# EAGLE design Board 7 Segment (EAGLE 6.5.0)
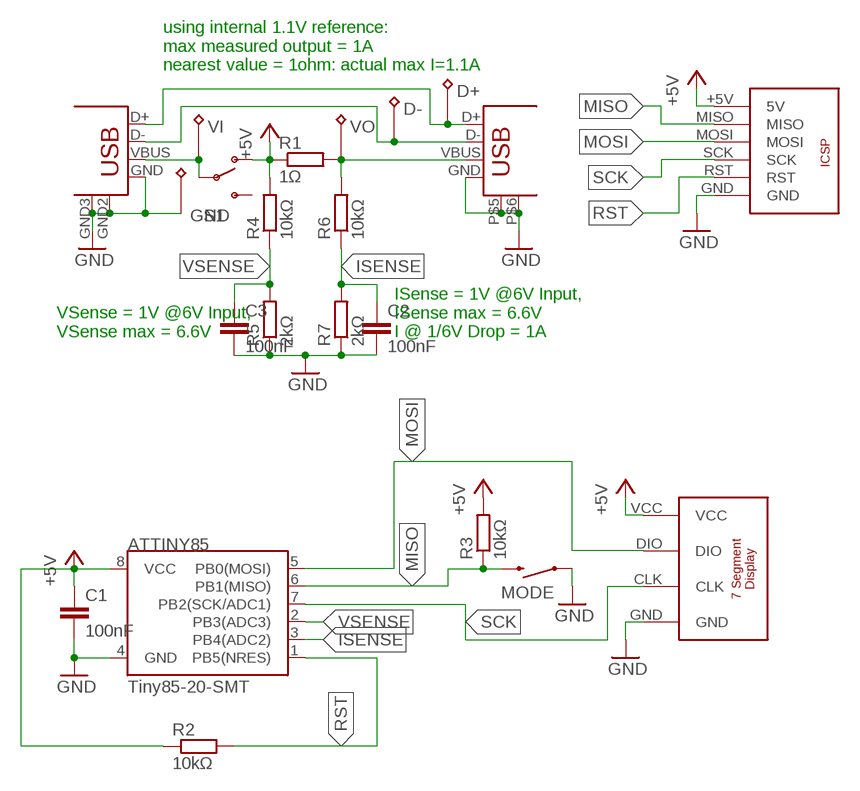
[diagram p0: schematic, sheet 1]

## Parts
ATTINY85  Tiny85-20-SMT  ATTINY45TINY85-20-SMT  [SO08-EIAJ]
C1  100nF  C-EUC0603  [C0603]
C2  100nF  C-EUC0603  [C0603]
C3  100nF  C-EUC0603  [C0603]
D+  TESTPOINT0.8MM-DUAL-DRILL-WIRE-LOOP  [TP-0.8MM-DUAL]
D-  TESTPOINT0.8MM-DUAL-DRILL-WIRE-LOOP  [TP-0.8MM-DUAL]
GND  TESTPOINT0.8MM-DUAL-DRILL-WIRE-LOOP  [TP-0.8MM-DUAL]
INPUT  USB+SHIELDTHROUGHHOLE-MALE  [USB-A-H]
MODE  SWITCH-MOMENTARY-2SIDE_EZ  [TACTILE-PTH-SIDEEZ]
OUTPUT  USB+SHIELDTHROUGHOLE-FEMALE  [USB-A-S-SILK-THROUGHHOLE]
R1  1Ω  R-EU_R2512  [R2512]
R2  10kΩ  R-EU_R0603  [R0603]
R3  10kΩ  R-EU_R0603  [R0603]
R4  10kΩ  R-EU_R0603  [R0603]
R5  2kΩ  R-EU_R0603  [R0603]
R6  10kΩ  R-EU_R0603  [R0603]
R7  2kΩ  R-EU_R0603  [R0603]
S1  SWITCH-SPDT-SMD-A  [SWITCH-SPST-SMD-A]
U$1  ICSPTHROUGHHOLE  [ICSP-THROUGHHOLE]
U$2  7-SEGMENT-I2C  [7-SEGMENT-I2C]
VI  TESTPOINT0.8MM-DUAL-DRILL-WIRE-LOOP  [TP-0.8MM-DUAL]
VO  TESTPOINT0.8MM-DUAL-DRILL-WIRE-LOOP  [TP-0.8MM-DUAL]

## Nets
+5V: ATTINY85.8(VCC) C1.1 R1.1 R2.1 R3.2 R4.2 S1.1(O) U$1.+5V(5V) U$2.VCC
GND: ATTINY85.4(GND) C1.2 C2.2 C3.2 GND.P$1(TP) GND.P$2(TP) INPUT.GND INPUT.GND2(S1) INPUT.GND3(S2) MODE.1 OUTPUT.GND OUTPUT.P$5(S1) OUTPUT.P$6(S2) R5.1 R7.1 U$1.GND U$2.GND
ISENSE: ATTINY85.3(PB4(ADC2)) C2.1 R6.1 R7.2
MISO: ATTINY85.6(PB1(MISO)) MODE.2 R3.1 U$1.MISO
MOSI: ATTINY85.5(PB0(MOSI)) U$1.MOSI U$2.DIO
N$1: D+.P$1(TP) D+.P$2(TP) INPUT.D+ OUTPUT.D+
N$2: D-.P$1(TP) D-.P$2(TP) INPUT.D- OUTPUT.D-
N$3: INPUT.VBUS S1.2(P) VI.P$1(TP) VI.P$2(TP)
N$6: OUTPUT.VBUS R1.2 R6.2 VO.P$1(TP) VO.P$2(TP)
RST: ATTINY85.1(PB5(NRES)) R2.2 U$1.RST
SCK: ATTINY85.7(PB2(SCK/ADC1)) U$1.SCK U$2.CLK
VSENSE: ATTINY85.2(PB3(ADC3)) C3.1 R4.1 R5.2
Unconnected: S1.3(S)

## Notes on the sheet
- using internal 1.1V reference:
  max measured output = 1A
  nearest value = 1ohm: actual max I=1.1A
- VSense = 1V @6V Input, 
  VSense max = 6.6V
- ISense = 1V @6V Input, 
  ISense max = 6.6V
  I @ 1/6V Drop = 1A

## Library data of the parts
ATTINY85 = SparkFun-DigitalIC:ATTINY45: Atmel 8-pin 2/4/8kB flash uC; PROD_ID: IC-09092
C1-C3 = rcl:C-EU: CAPACITOR, European symbol
D+ D- GND VI VO = OwnStuff:TESTPOINT
INPUT OUTPUT = SparkFun-Connectors:USB+SHIELD: USB+Shield USB connector with shield pins connectable
MODE = SparkFun-Electromechanical:SWITCH-MOMENTARY-2: Various NO switches- pushbuttons, reed, etc
R1-R7 = rcl:R-EU_: RESISTOR, European symbol
S1 = SparkFun-Electromechanical:SWITCH-SPDT: SPDT Switch Simple slide switch, Spark Fun Electronics SKU : COM-00102 DPDT SMT slide switch, AYZ0202, SWCH-08179
U$1 = OwnStuff:ICSP
U$2 = OwnStuff:7-SEGMENT-I2C

## Board
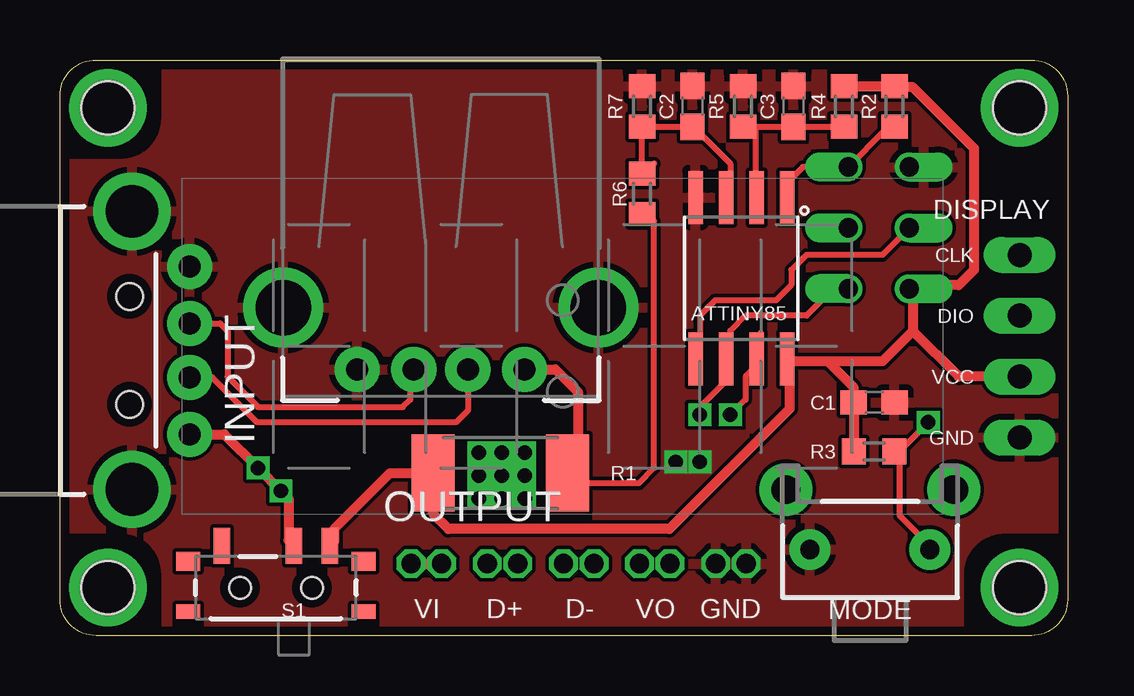
[diagram p1: board, top side]
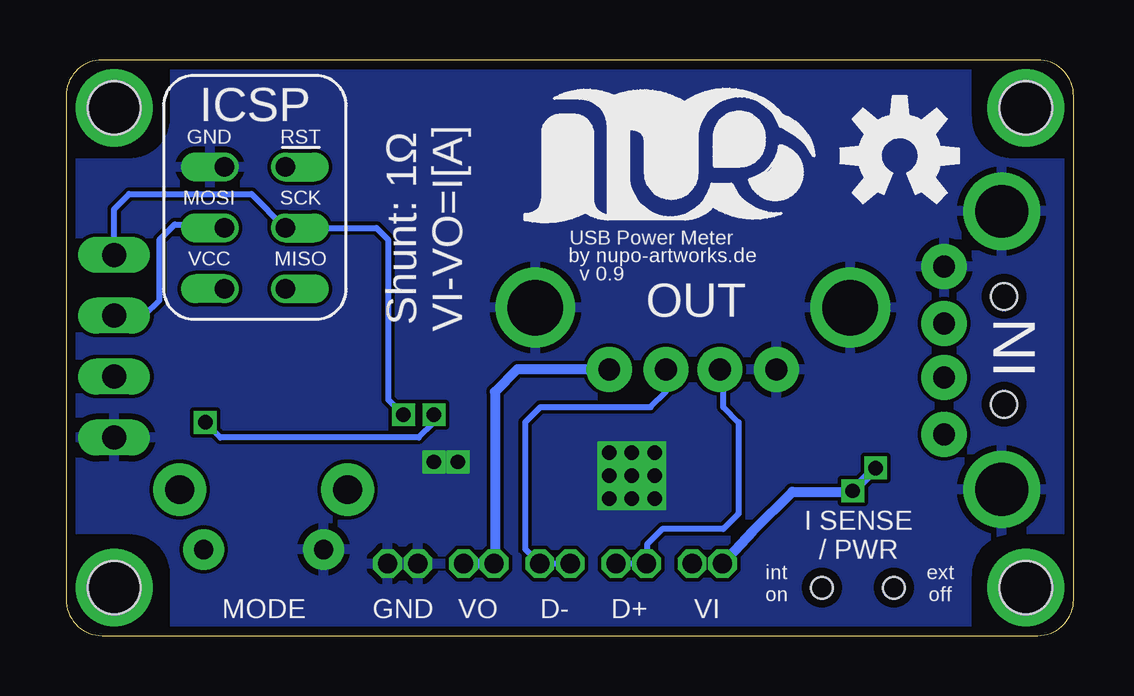
[diagram p2: board, bottom side, seen from below]

Size 42 x 24 mm. Coordinates in mm from the lower left corner, seen from the top.
Outline: 0,1.5 0,22.5 arc-90 1.5,24 40.5,24 arc-90 42,22.5 42,1.5 arc-90 40.5,0 1.5,0 arc-90 0,1.5
Copper layers (1*16): Top 0.0356mm / dielectric 1.5011mm / Bottom 0.0356mm
Design rules "LaenPCBOrder *": minimum track width 6mil, minimum drill 13mil, track to track 6mil, track to pad 6mil, pad to pad 6mil, via to via 6mil, smd to smd 6mil, copper to edge 15mil, drill to drill 6mil, minimum pad ring 7mil, minimum via ring 7mil, stop-mask expansion 3mil, vias tented up to drill 13mil, thermal gap 10mil

### Footprints (pad centres in the part's own frame; a part is rotated, then mirrored left to right if it is on the bottom)
SO08-EIAJ = smd 0.61 x 2.21: 1 -1.905,-3.378; 2 -0.635,-3.378; 3 0.635,-3.378; 4 1.905,-3.378; 5 1.905,3.353; 6 0.635,3.353; 7 -0.635,3.353; 8 -1.905,3.353
C0603 = smd 1.1 x 1: 1 -0.85,0; 2 0.85,0
TP-0.8MM-DUAL = drill 0.8 octagon: P$1 0,0; P$2 0,1.27
USB-A-H = drill 0.914 pad 1.88: D+ 2.4,1.127; D- 2.4,-1.127; GND 2.4,3.5; VBUS 2.4,-3.5 | drill 2.2: GND2 0,-5.8; GND3 0,5.8 | hole 1.1: -0.1,2.25; -0.1,-2.25
TACTILE-PTH-SIDEEZ = drill 0.8 pad 1.7: 1 -2.5,0; 2 2.5,0 | drill 1.2 pad 2.2: ANCHOR1 -3.5,2.5; ANCHOR2 3.5,2.5
USB-A-S-SILK-THROUGHHOLE = drill 0.914 pad 1.88: D+ 3.035,-1.127; D- 3.035,1.127; GND 3.035,-3.485; VBUS 3.035,3.485 | drill 2.311: P$5 0.46,-6.566; P$6 0.46,6.566
R2512 = smd 1.8 x 3.2: 1 -2.8,0; 2 2.8,0
R0603 = smd 1 x 1.1: 1 -0.85,0; 2 0.85,0
SWITCH-SPST-SMD-A = smd 0.7 x 1.5: 1 -2.25,-1.75; 2 -0.75,-1.75; 3 2.25,-1.75 | smd 1 x 0.6: GND1 -3.65,1; GND3 3.65,1 | smd 1 x 0.8: GND2 -3.65,-1.1; GND4 3.65,-1.1 | hole 0.9: -1.5,0; 1.5,0
ICSP-THROUGHHOLE = drill 0.8 offset: +5V 1.27,2.54; GND 1.27,-2.54; MISO -1.27,2.54; MOSI 1.27,0; RST -1.27,-2.54; SCK -1.27,0
7-SEGMENT-I2C = drill 1 long: CLK 40.005,15.875; DIO 40.005,13.335; GND 40.005,8.255; VCC 40.005,10.795 | hole 2.2: 2,22; 2,2; 40,2; 40,22

### Placement (x,y rotation side)
ATTINY85  28.4,14.89 180 top
C1  33.94,9.71 0 top
C2  26.37,22.07 90 top
C3  30.58,22.07 90 top
D+  19.08,3 90 top
D-  22.25,3 90 top
GND  28.61,3 90 top
INPUT  3,11.89 0 top
MODE  33.77,3.59 0 top
OUTPUT  15.88,14.13 270 top
R1  18.35,6.78 0 top
R2  34.78,22.07 270 top
R3  33.94,7.68 180 top
R4  32.69,22.07 90 top
R5  28.48,22.07 270 top
R6  24.27,18.41 270 top
R7  24.27,22.07 270 top
S1  9,2 180 top
U$1  34.13,17 180 bottom
U$2  0,0 0 top
U$3  [OSHW-LOGO-M]  7.25,20 0 bottom
U$5  [LOGO-SILKSCREEN]  17,19 0 bottom
VI  15.9,3 90 top
VO  25.43,3 90 top

### Tracks (layer width: path | path; a pad name or v marks a point on that pad's centre or on a via)
+5V
  Top 0.406: U$2.VCC 37.47,10.79 35.56,12.7 | 35.56,12.7 35.56,14.3 U$1.+5V 35.55,14.61 37.47,14.61 38.1,15.24 38.1,20.32 35.56,22.86 34.8,22.86 R2.1 R4.2 | 35.56,12.7 34.29,11.43 32,11.43 | 32,11.43 30.41,11.43 | 30.41,11.43 ATTINY85.8 | 30.41,11.43 30.41,9.46 25.4,4.45 16.19,4.45 15.56,5.08 R1.1 13.77,6.78 11.43,4.45 11.43,3.93 S1.1 | R3.2 C1.1 33.09,10.34 32,11.43
GND  (via drill 0.6)
  Top 1.27: INPUT.GND2 2.8,6.09 | 2.54,17.78 2.91,17.78 INPUT.GND3
  other vias: 25.67,7.24 26.67,7.24
  pour Top: 0,19.68 2.54,19.68 arc90 4.45,21.59 4.45,24.13 37.47,24.13 37.47,21.59 arc90 39.37,19.68 41.91,19.68 41.91,4.45 39.37,4.45 arc90 37.47,2.54 37.47,0 4.45,0 4.45,2.54 arc90 2.54,4.45 0,4.45
  pour Bottom: 0,19.68 2.54,19.68 arc90 4.45,21.59 4.45,24.13 37.47,24.13 37.47,21.59 arc90 39.37,19.68 41.91,19.68 41.91,4.45 39.37,4.45 arc90 37.47,2.54 37.47,0 4.45,0 4.45,2.54 arc90 2.54,4.45 0,4.45
ISENSE
  Top 0.254: 24.77,19.68 R6.1 R7.2 C2.1 26.47,21.16 27.94,19.68 27.94,18.44 ATTINY85.3
MISO  (via drill 0.6)
  Top 0.254: v26.67,9.21 26.67,9.53 27.94,10.79 27.94,11.36 ATTINY85.6 27.94,11.71 27.94,12.7 28.57,13.34 31.11,13.34 32.24,14.46 U$1.MISO | v36.2,8.89 35.15,7.85 34.98,7.68 R3.1 35,7.47 35,5 36.27,3.73 MODE.2
  Bottom 0.254: v26.67,9.21 26.67,8.89 27.3,8.26 35.56,8.26 v36.2,8.89
MOSI
  Top 0.254: U$1.MOSI 35.4,16.98 34.29,15.88 31.11,15.88 30.48,15.24 30.48,14.61 29.84,13.97 27.3,13.97 26.67,13.34 26.67,11.71 ATTINY85.5
  Bottom 0.254: U$1.MOSI 35.55,17.14 37.47,17.14 38.1,16.51 38.1,13.97 38.73,13.34 U$2.DIO
N$1
  Top 0.254: INPUT.D+ 6.67,13.02 6.99,12.7 6.99,10.79 8.26,9.53 14.29,9.53 14.61,9.84 14.61,10.95 OUTPUT.D+
  Bottom 0.254: D+.P$1 D+.P$2 17.78,3.03 17.78,3.81 17.14,4.45 14.61,4.45 13.97,5.08 13.97,8.89 14.61,9.53 14.61,10.95 OUTPUT.D+
N$2
  Top 0.254: OUTPUT.D- 17,9.38 16.51,8.89 8.22,8.89 6.35,10.76 INPUT.D-
  Bottom 0.254: D-.P$2 D-.P$1 22.86,3.6 22.86,8.89 22.23,9.53 17.64,9.53 17,10.16 OUTPUT.D-
N$3  (via drill 0.6)
  Top 0.254: 9.69,3.81 S1.2
  Top 0.406: INPUT.VBUS 6.85,8.39 v8.26,6.99 v9.21,6.03 9.53,5.71 9.53,3.98 S1.2 | VI.P$2 VI.P$1
  Bottom 0.406: VI.P$2 13.37,4.37 11.73,6 9.24,6 v9.21,6.03 v8.26,6.99 8.12,7.12
N$5  (via drill 0.6)
  other vias: 17.46,6.67 17.46,7.62 18.41,7.62 19.37,7.62 19.37,6.67 19.37,5.71 18.41,5.71 17.46,5.71 18.41,6.67
  pour Bottom (isolate 0.305): 14.61,8.26 14.61,5.08 22.23,5.08 22.23,8.26
N$6
  Top 0.254: R1.2 21.58,6.35 24.13,6.35 24.77,6.99 24.77,17.27 R6.2
  Top 0.406: OUTPUT.VBUS 20.66,11.1 21.59,10.16 21.59,7.22 R1.2
  Bottom 0.406: VO.P$1 VO.P$2 24.13,3.03 24.13,10.16 23.2,11.1 OUTPUT.VBUS
N$7  (via drill 2.2)
  other vias: 2,22
N$9  (via drill 2.2)
  other vias: 2,2
N$10  (via drill 2.2)
  other vias: 40,2
N$11  (via drill 2.2)
  other vias: 40,22
RST
  Top 0.254: R2.2 34.38,21.07 U$1.RST 30.97,19.54 30.48,19.05 30.48,18.44 ATTINY85.1
SCK  (via drill 0.6)
  Top 0.254: ATTINY85.7 29.21,12.63 29.21,11.43 28.57,10.79 28.57,9.84 v27.94,9.21
  Bottom 0.254: U$2.CLK 40.01,17.78 39.37,18.41 34.27,18.41 U$1.SCK 29.07,17 28.57,16.51 28.57,9.84 v27.94,9.21
VSENSE
  Top 0.254: 29.21,18.44 ATTINY85.2 29,18.27 29,21.22 | R5.2 29,21.22 | 29,21.22 C3.1 R4.1

### Text on the board
bPlace: Shunt: 1Ω / VI-VO=I[A] | OUT | IN
bNames: USB Power Meter | by nupo-artworks.de | v 0.9 | I SENSE / / PWR | ext / off | int / on | VI | D+ | D- | VO | GND | MODE